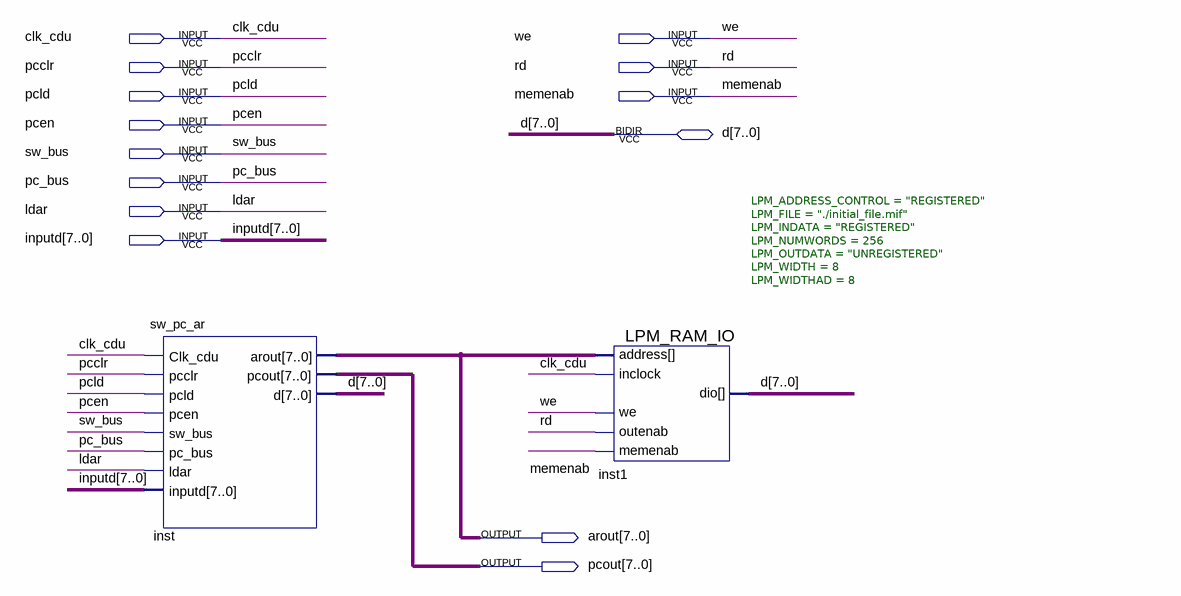
[diagram p0: schematic sheet]
// Quartus schematic exp_ram.bdf as structural Verilog: 2 symbols, 14 pins
module exp_ram (
  input  clk_cdu,
  input  we,
  input  pcclr,
  input  rd,
  input  pcld,
  input  memenab,
  input  pcen,
  input  sw_bus,
  input  pc_bus,
  input  ldar,
  input  [7:0] inputd,
  inout  [7:0] d,
  output [7:0] arout,
  output [7:0] pcout
);

  sw_pc_ar inst (
    .Clk_cdu(clk_cdu), .pcclr(pcclr), .pcld(pcld), .pcen(pcen), .sw_bus(sw_bus), .pc_bus(pc_bus),
    .ldar(ldar), .inputd(inputd), .arout(arout), .pcout(pcout), .d(d));
  LPM_RAM_IO #(.LPM_ADDRESS_CONTROL("REGISTERED"), .LPM_FILE("./initial_file.mif"), .LPM_INDATA("REGISTERED"), .LPM_NUMWORDS(256), .LPM_OUTDATA("UNREGISTERED"), .LPM_WIDTH(8), .LPM_WIDTHAD(8)) inst1 (
    .address(arout), .memenab(memenab), .inclock(clk_cdu), .we(we), .outenab(rd), .dio(d));
endmodule
